# Altium schematic sheet Connectors.SchDoc
size A; SheetNumber: 5; SheetTotal: 6
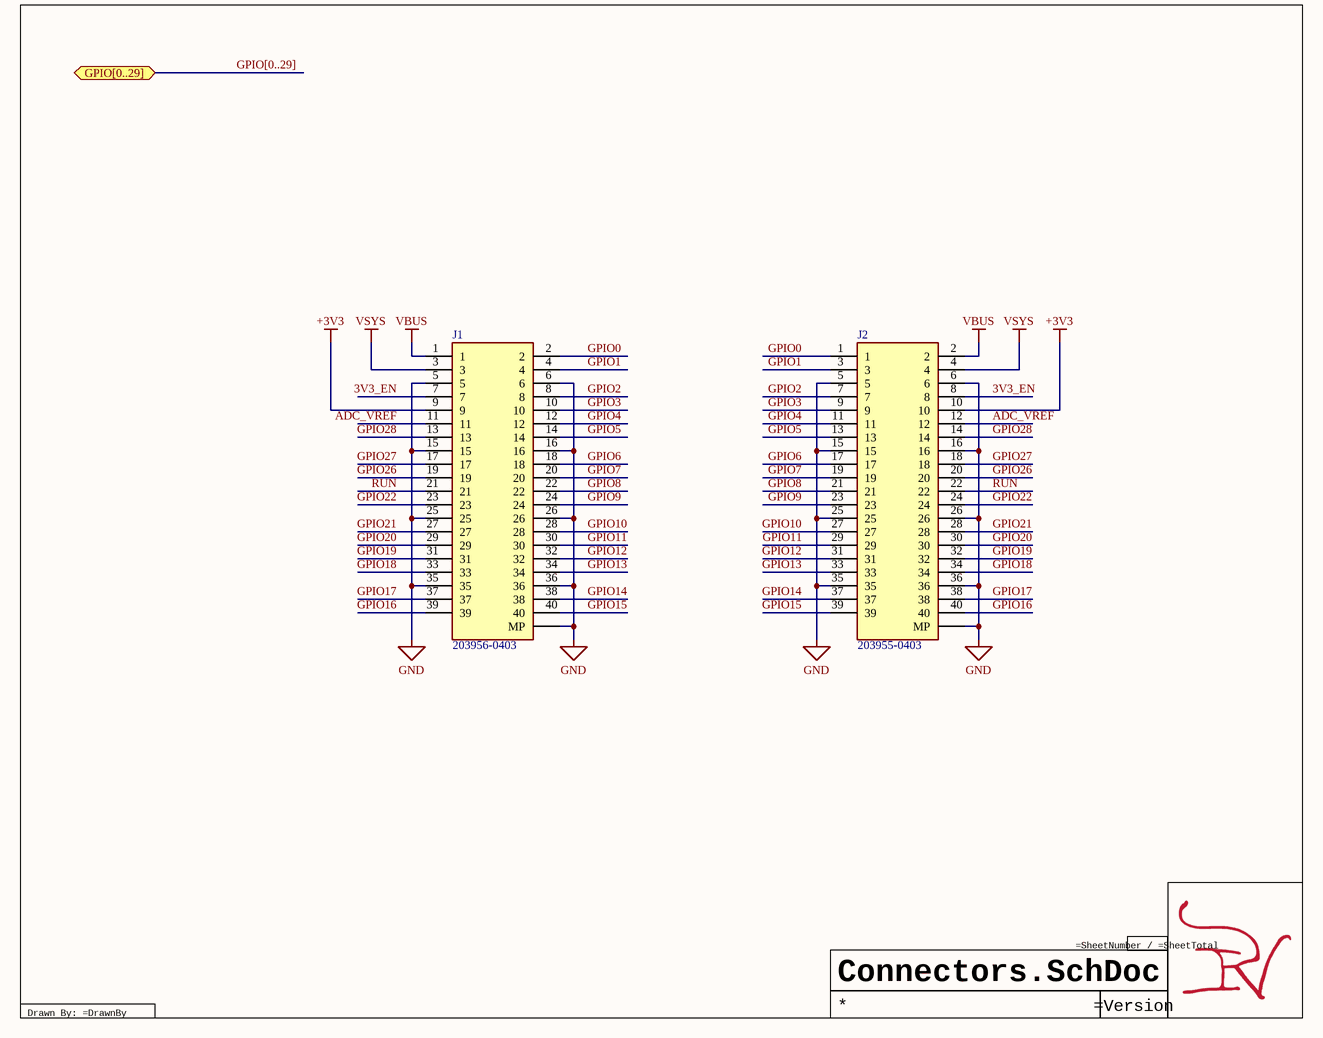
[diagram p0: Connectors.SchDoc]

## Parts
J1  203956-0403  [2039560403]
J2  203955-0403  [2039550403]

## Ports
GPIO[0..29] (bidir, see LEDMatrix[3B], Controller[1B])

## Nets
+3V3: J1.9 J2.10
GND: J1.5 J1.6 J1.15 J1.16 J1.25 J1.26 J1.35 J1.36 J1.MP1,_MP2,_MP3,_MP4(MP) J2.5 J2.6 J2.15 J2.16 J2.25 J2.26 J2.35 J2.36 J2.MP1,_MP2,_MP3,_MP4(MP)
VBUS: J1.1 J2.2
VSYS: J1.3 J2.4
3V3_EN: J1.7 J2.8
ADC_VREF: J1.11 J2.12
GPIO0: J1.2 J2.1
GPIO1: J1.4 J2.3
GPIO2: J1.8 J2.7
GPIO3: J1.10 J2.9
GPIO4: J1.12 J2.11
GPIO5: J1.14 J2.13
GPIO6: J1.18 J2.17
GPIO7: J1.20 J2.19
GPIO8: J1.22 J2.21
GPIO9: J1.24 J2.23
GPIO10: J1.28 J2.27
GPIO11: J1.30 J2.29
GPIO12: J1.32 J2.31
GPIO13: J1.34 J2.33
GPIO14: J1.38 J2.37
GPIO15: J1.40 J2.39
GPIO16: J1.39 J2.40
GPIO17: J1.37 J2.38
GPIO18: J1.33 J2.34
GPIO19: J1.31 J2.32
GPIO20: J1.29 J2.30
GPIO21: J1.27 J2.28
GPIO22: J1.23 J2.24
GPIO26: J1.19 J2.20
GPIO27: J1.17 J2.18
GPIO28: J1.13 J2.14
RUN: J1.21 J2.22

## Buses and harness runs
bus GPIO[0..29] = port GPIO[0..29]

## Notes on the sheet
- Drawn By: =DrawnBy

## Library data of the parts
J1 = CMP-702-000004-3: SlimStack Board-to-Board Plug, 0.40mm Pitch, FSB5 Floating Series, 5.00mm Mated Height, 3.80 Mated Width, 40 Circuits; Manufacturer_Name: Molex; Source: SamacSys.SchLib; Datasheet Link: https://www.molex.com/pdm_docs/sd/2039560403_sd.pdf; Height: 4.55mm; Design Item ID: 203956-0403; Manufacturer_Part_Number: 203956-0403; Mouser Price/Stock: https://www.mouser.co.uk/ProductDetail/Molex/203956-0403?qs=GBLSl2AkiruaR3IeSUTGlg%3D%3D; Mouser Part Number: 538-203956-0403
J2 = CMP-702-000003-3: SlimStack Board-to-Board Receptacle, 0.40mm Pitch, FSB5 Floating Series, 5.00mm Mated Height, 3.80mm Mated Width, 40...; Manufacturer_Name: Molex; Mouser Price/Stock: https://www.mouser.co.uk/ProductDetail/Molex/203955-0403?qs=GBLSl2Akirtl%2FPuTWbQ1%252BQ%3D%3D; Height: 3.1mm; Design Item ID: 203955-0403; Mouser Part Number: 538-203955-0403; Manufacturer_Part_Number: 203955-0403; Datasheet Link: https://www.molex.com/pdm_docs/sd/2039550403_sd.pdf; Source: SamacSys.SchLib